# EAGLE schematic Arduino_DUE_Shield_V02d-2Layer (2) (EAGLE 7.1.0)
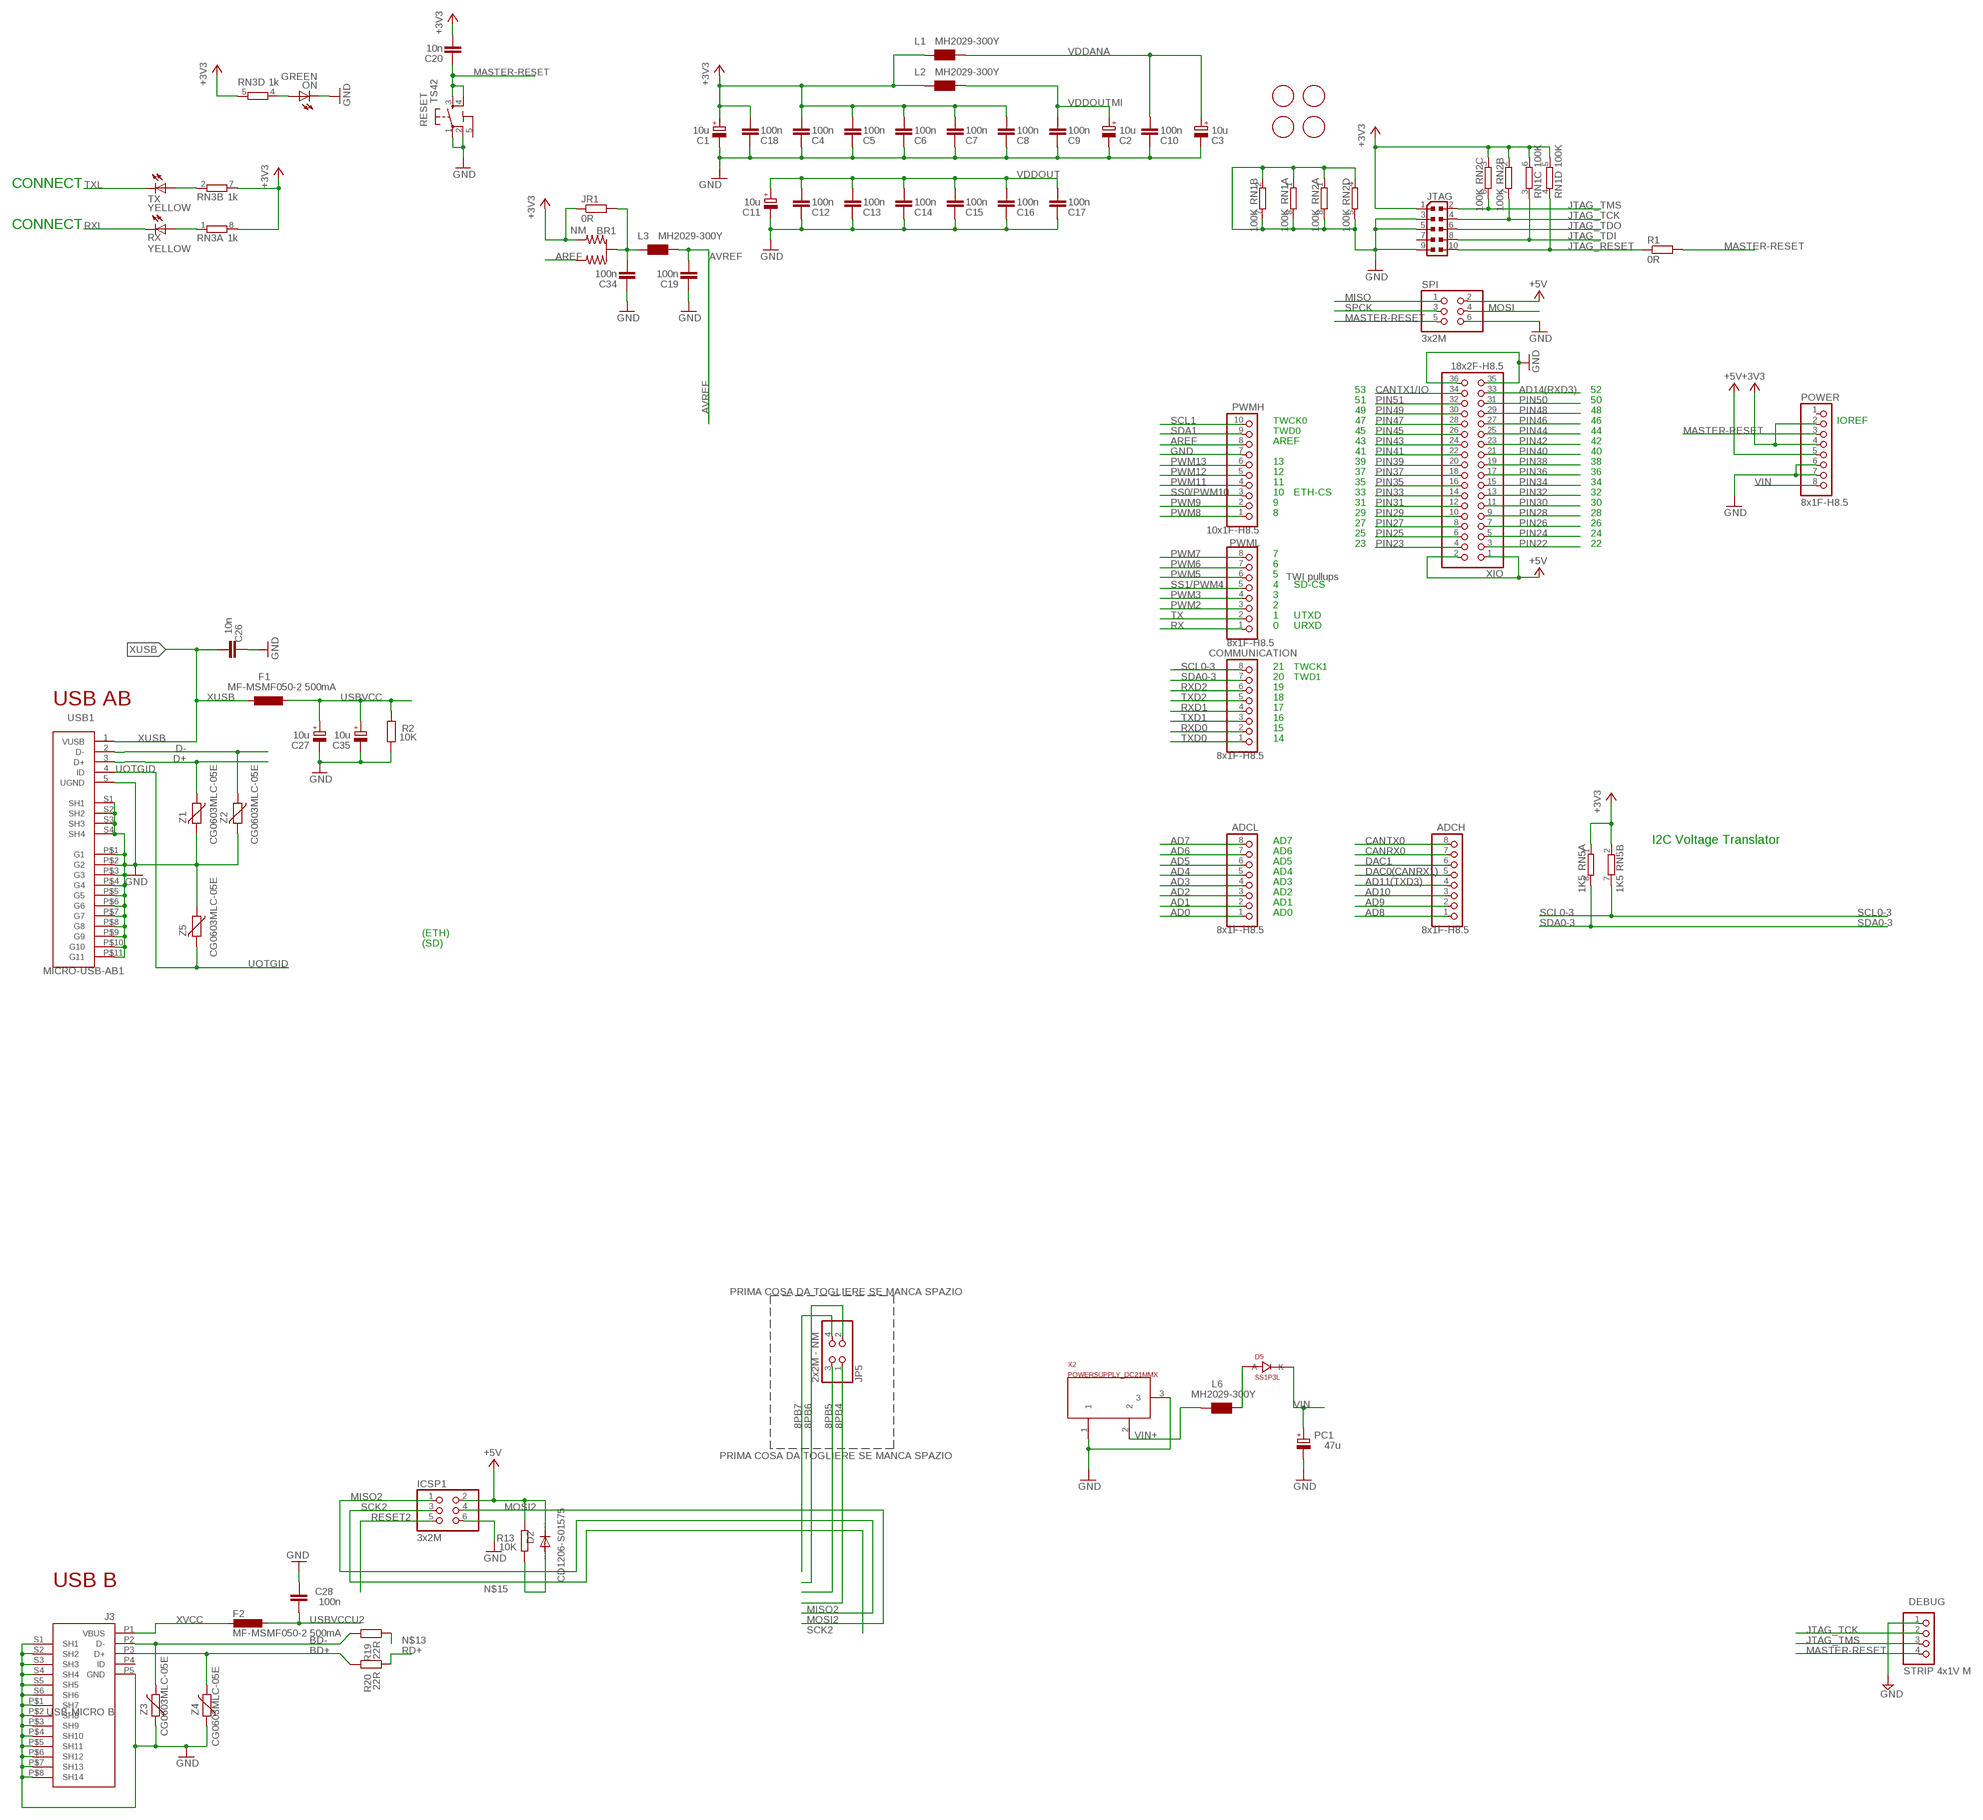
[diagram p0: schematic, sheet 1]

## Parts
ADCH  8x1F-H8.5  PINHD-1X8  [1X08]
ADCL  8x1F-H8.5  PINHD-1X8  [1X08]
BR1  NM  J0402  [J0402]
C1  10u  CPOL-EUSMCB  [SMC_B]
C2  10u  CPOL-EUSMCB  [SMC_B]
C3  10u  CPOL-EUSMCB  [SMC_B]
C4  100n  C-EUC0402  [C0402]
C5  100n  C-EUC0402  [C0402]
C6  100n  C-EUC0402  [C0402]
C7  100n  C-EUC0402  [C0402]
C8  100n  C-EUC0402  [C0402]
C9  100n  C-EUC0402  [C0402]
C10  100n  C-EUC0402  [C0402]
C11  10u  CPOL-EUSMCB  [SMC_B]
C12  100n  C-EUC0402  [C0402]
C13  100n  C-EUC0402  [C0402]
C14  100n  C-EUC0402  [C0402]
C15  100n  C-EUC0402  [C0402]
C16  100n  C-EUC0402  [C0402]
C17  100n  C-EUC0402  [C0402]
C18  100n  C-EUC0402  [C0402]
C19  100n  C-EUC0402  [C0402]
C20  10n  C-EUC0402  [C0402]
C26  10n  C-EUC0402  [C0402]
C27  10u  CPOL-EUSMCB  [SMC_B]
C28  100n  C-EUC0402  [C0402]
C34  100n  C-EUC0402  [C0402]
C35  10u  CPOL-EUSMCB  [SMC_B]
COMMUNICATION  8x1F-H8.5  PINHD-1X8  [1X08]
D2  CD1206-S01575  DIODE-MINIMELF  [MINIMELF]
D5  SS1P3L  [DO220AAL]
DEBUG  STRIP 4x1V M  PINHD-1X4  [1X04]
F1  MF-MSMF050-2 500mA  L-EUL1812  [L1812]
F2  MF-MSMF050-2 500mA  L-EUL1812  [L1812]
FID1  FIDUCIALMOUNT  [FIDUCIA-MOUNT]
FID2  FIDUCIALMOUNT  [FIDUCIA-MOUNT]
FID3  FIDUCIALMOUNT  [FIDUCIA-MOUNT]
FID4  FIDUCIALMOUNT  [FIDUCIA-MOUNT]
ICSP1  3x2M  PINHD-2X3  [2X03]
J3  USB-MICRO B  MYCON2_USB-MINI-B  [CON2_USB_MICRO_B_AT]
JP5  2x2M - NM  PINHD-2X2  [2X02]
JR1  0R  R-EU_R0402  [R0402]
JTAG  PINHEAD_PINHD-2X5PASSO127  [PINHEAD_2X05_127]
L1  MH2029-300Y  WE-CBF_0805  [0805]
L2  MH2029-300Y  WE-CBF_0805  [0805]
L3  MH2029-300Y  WE-CBF_0805  [0805]
L6  MH2029-300Y  WE-CBF_0805  [0805]
ON  GREEN  LEDCHIP-LED0805  [CHIP-LED0805]
PC1  47u  CPOL-EUD  [PANASONIC_D]
POWER  8x1F-H8.5  PINHD-1X8  [1X08]
PWMH  10x1F-H8.5  PINHD-1X10  [1X10]
PWML  8x1F-H8.5  PINHD-1X8  [1X08]
R1  0R  R-EU_R0402  [R0402]
R2  10K  R-EU_R0402  [R0402]
R13  10K  R-EU_R0402  [R0402]
R19  22R  R-EU_R0402  [R0402]
R20  22R  R-EU_R0402  [R0402]
RESET  TS42  [TS42]
RN1  100K  4R-NCAT16  [CAT16]
RN2  100K  4R-NCAT16  [CAT16]
RN3  1k  4R-NCAY16  [CAY16]
RN5  1K5  4R-NCAT16  [CAT16]
RX  YELLOW  LEDCHIP-LED0805  [CHIP-LED0805]
SPI  3x2M  PINHD-2X3  [2X03]
TX  YELLOW  LEDCHIP-LED0805  [CHIP-LED0805]
USB1  MICRO-USB-AB1  MICRO_USB  [MCR-AB1-S-RA-SMT]
X2  POWERSUPPLY_DC21MMX  [POWERSUPPLY_DC-21MM]
XIO  18x2F-H8.5  PINHD-2X18  [2X18]
Z1  CG0603MLC-05E  VARISTORCN0603  [CT/CN0603]
Z2  CG0603MLC-05E  VARISTORCN0603  [CT/CN0603]
Z3  CG0603MLC-05E  VARISTORCN0603  [CT/CN0603]
Z4  CG0603MLC-05E  VARISTORCN0603  [CT/CN0603]
Z5  CG0603MLC-05E  VARISTORCN0603  [CT/CN0603]

## Nets
8PB4: JP5.1
8PB5: JP5.3
8PB6: JP5.2
8PB7: JP5.4
+3V3: BR1.3 C1.+ C4.2 C5.2 C6.2 C7.2 C8.2 C18.2 C20.2 JR1.1 JTAG.1 L1.1 L2.1 POWER.2 POWER.4 RN1.5 RN1.6 RN2.2 RN2.3 RN3.5 RN3.7 RN3.8 RN5.1 RN5.2
+5V: D2.C ICSP1.2 POWER.5 R13.2 SPI.2 XIO.1 XIO.2
AD0: ADCL.1
AD1: ADCL.2
AD2: ADCL.3
AD3: ADCL.4
AD4: ADCL.5
AD5: ADCL.6
AD6: ADCL.7
AD7: ADCL.8
AD8: ADCH.1
AD9: ADCH.2
AD10: ADCH.3
AD11(TXD3): ADCH.4
AD14(RXD3): XIO.33
AREF: BR1.1 PWMH.8
AVREF: C19.2 L3.2
AVREFL: BR1.2(C) C34.2 JR1.2 L3.1
BD+ [USB]: J3.P3(D+) R20.2 Z4.2
BD- [USB]: J3.P2(D-) R19.2 Z3.2
CANRX0: ADCH.7
CANTX0: ADCH.8
CANTX1/IO: XIO.34
D+ [USBpair]: USB1.3(D+) Z1.1
D- [USBpair]: USB1.2(D-) Z2.1
DAC0(CANRX1): ADCH.5
DAC1: ADCH.6
GND: C1.- C2.- C3.- C4.1 C5.1 C6.1 C7.1 C8.1 C9.1 C10.1 C11.- C12.1 C13.1 C14.1 C15.1 C16.1 C17.1 C18.1 C19.1 C26.2 C27.- C28.2 C34.1 C35.- DEBUG.1 ICSP1.6 J3.P5(GND) J3.P$1(SH7) J3.P$2(SH8) J3.P$3(SH9) J3.P$4(SH10) J3.P$5(SH11) J3.P$6(SH12) J3.P$7(SH13) J3.P$8(SH14) J3.S1(SH1) J3.S2(SH2) J3.S3(SH3) J3.S4(SH4) J3.S5(SH5) J3.S6(SH6) JTAG.3 JTAG.5 JTAG.9 ON.C PC1.- POWER.6 POWER.7 PWMH.7 R2.1 RESET.1 RESET.2 RN1.1 RN1.2 RN1.7 RN1.8 RN2.1 RN2.4 RN2.5 RN2.8 SPI.6 USB1.5(UGND) USB1.P$1(G1) USB1.P$2(G2) USB1.P$3(G3) USB1.P$4(G4) USB1.P$5(G5) USB1.P$6(G6) USB1.P$7(G7) USB1.P$8(G8) USB1.P$9(G9) USB1.P$10(G10) USB1.P$11(G11) USB1.S1(SH1) USB1.S2(SH2) USB1.S3(SH3) USB1.S4(SH4) X2.1 X2.3 XIO.35 XIO.36 Z1.2 Z2.2 Z3.1 Z4.1 Z5.1
JTAG_RESET: JTAG.10 R1.1 RN1.4
JTAG_TCK: DEBUG.2 JTAG.4 RN2.7
JTAG_TDI: JTAG.8 RN1.3
JTAG_TDO: JTAG.6
JTAG_TMS: DEBUG.3 JTAG.2 RN2.6
MASTER-RESET: C20.1 DEBUG.4 POWER.3 R1.2 RESET.3 RESET.4 SPI.5
MISO: SPI.1
MISO2: ICSP1.1
MOSI: SPI.4
MOSI2: ICSP1.4
N$3: ON.A RN3.4
N$10: D5.P$2(A) L6.1
N$13: R19.1
N$15: D2.A R13.1
N$54: RN3.1 RX.A
N$55: RN3.2 TX.A
PIN22: XIO.3
PIN23: XIO.4
PIN24: XIO.5
PIN25: XIO.6
PIN26: XIO.7
PIN27: XIO.8
PIN28: XIO.9
PIN29: XIO.10
PIN30: XIO.11
PIN31: XIO.12
PIN32: XIO.13
PIN33: XIO.14
PIN34: XIO.15
PIN35: XIO.16
PIN36: XIO.17
PIN37: XIO.18
PIN38: XIO.19
PIN39: XIO.20
PIN40: XIO.21
PIN41: XIO.22
PIN42: XIO.23
PIN43: XIO.24
PIN44: XIO.25
PIN45: XIO.26
PIN46: XIO.27
PIN47: XIO.28
PIN48: XIO.29
PIN49: XIO.30
PIN50: XIO.31
PIN51: XIO.32
PWM2: PWML.3
PWM3: PWML.4
PWM5: PWML.6
PWM6: PWML.7
PWM7: PWML.8
PWM8: PWMH.1
PWM9: PWMH.2
PWM11: PWMH.4
PWM12: PWMH.5
PWM13: PWMH.6
RD+: R20.1
RESET2: ICSP1.5
RX: PWML.1
RXD0: COMMUNICATION.2
RXD1: COMMUNICATION.4
RXD2: COMMUNICATION.6
RXL: RX.C
SCK2: ICSP1.3
SCL0-3: COMMUNICATION.8 RN5.7
SCL1: PWMH.10
SDA0-3: COMMUNICATION.7 RN5.8
SDA1: PWMH.9
SPCK: SPI.3
SS0/PWM10: PWMH.3
SS1/PWM4: PWML.5
TX: PWML.2
TXD0: COMMUNICATION.1
TXD1: COMMUNICATION.3
TXD2: COMMUNICATION.5
TXL: TX.C
UOTGID: USB1.4(ID) Z5.2
USBVCC: C27.+ C35.+ F1.1 R2.2
USBVCCU2: C28.1 F2.1
VDDANA: C3.+ C10.2 L1.2
VDDOUT: C11.+ C12.2 C13.2 C14.2 C15.2 C16.2 C17.2
VDDOUTMI: C2.+ C9.2 L2.2
VIN: D5.P$1(K) PC1.+ POWER.8
VIN+: L6.2 X2.2
XUSB [usbvcc]: C26.1 F1.2 USB1.1(VUSB)
XVCC [usbvcc]: F2.2 J3.P1(VBUS)
Unconnected: J3.P4(ID) JTAG.7 POWER.1 RN3.3 RN3.6 RN5.3 RN5.4 RN5.5 RN5.6

## Notes on the sheet
- CONNECT
- CONNECT
- 53 | 52
- 51 | 50
- 49 | 48
- TWCK0 | 47 | 46 | IOREF
- TWD0 | 45 | 44
- AREF | 43 | 42
- 41 | 40
- 13 | 39 | 38
- 12 | 37 | 36
- 11 | 35 | 34
- 10 | ETH-CS | 33 | 32
- 9 | 31 | 30
- 8 | 29 | 28
- 27 | 26
- 25 | 24
- 23 | 22
- 7
- 6
- 5 | TWI pullups
- 4 | SD-CS
- 3
- 2
- 1 | UTXD
- 0 | URXD
- 21 | TWCK1
- 20 | TWD1
- USB AB | 19
- 18
- 17
- 16
- 15
- 14
- AD7 | I2C Voltage Translator
- AD6
- AD5
- AD4
- AD3
- AD2
- AD1
- AD0
- (ETH)
- (SD)
- PRIMA COSA DA TOGLIERE SE MANCA SPAZIO
- PRIMA COSA DA TOGLIERE SE MANCA SPAZIO
- USB B

## Power pins joined to a net without a drawn wire
5-GND: RESET.5(5-GND)

## Library data of the parts
ADCH ADCL COMMUNICATION POWER PWML = SmartPrj:PINHD-1X8: PIN HEADER
BR1 = bibaja:J: Three terminal jumper made from two 0402, 0603, 0805, etc.
C1-C3 C11 C27 C35 PC1 = rcl:CPOL-EU: POLARIZED CAPACITOR, European symbol
C4-C10 C12-C20 C26 C28 C34 = SmartPrj:C-EU: CAPACITOR, European symbol
D2 = diode:DIODE-: DIODE
D5 = SmartPrj:SS1P3L
DEBUG = pinhead:PINHD-1X4: PIN HEADER
F1 F2 = rcl:L-EU: INDUCTOR, European symbol
FID1-FID4 = SmartPrj:FIDUCIALMOUNT
ICSP1 SPI = SmartPrj:PINHD-2X3: PIN HEADER
J3 = SmartPrj:MYCON2_USB-MINI-B
JP5 = SmartPrj:PINHD-2X2: PIN HEADER
JR1 R1 R2 R13 R19 R20 = SmartPrj:R-EU_: RESISTOR, European symbol
JTAG = Arduino_Wifi_shield_v018_tG:PINHEAD_PINHD-2X5: PIN HEADER
L1-L3 L6 = wuerth-elektronik:WE-CBF: SMD EMI Suppression Ferrite Beads - excellent anti-EMI properties - low DCR - impedances till 3000 ohms - rated current up to 6 A
ON RX TX = led:LED: LED OSRAM: - CHIPLED LG R971, LG N971, LY N971, LG Q971, LY Q971, LO R971, LY R971 LH N974, LH R974 LS Q976, LO Q976, LY Q976 LO Q996 - Hyper CHIPLED LW Q18S LB Q993, LB Q99A, LB R99A - SideLED LS A670, LO A670, LY A670, LG A670, LP A670 LB A673, LV A673, LT A673, LW A673 LH A674 LY A675 LS A676, LA A676, LO A676, LY A676, LW A676 LS A679, LY A679, LG A679 - Hyper Micro SIDELED® LS Y876, LA Y876, LO Y876, LY Y876 LT Y87S - SmartLED LW L88C, LW L88S LB L89C, LB L89S, LG L890 LS L89K, LO L89K, LY L89K LS L896, LA L896, LO L896, LY L896 - TOPLED LS T670, LO T670, LY T670, LG T670, LP T670 LSG T670, LSP T670, LSY T670, LOP T670, LYG T670 LG T671, LOG T671, LSG T671 LB T673, LV T673, LT T673, LW T673 LH T674 LS T676, LA T676, LO T676, LY T676, LB T676, LH T676, LSB T676, LW T676 LB T67C, LV T67C, LT T67C, LS T67K, LO T67K, LY T67K, LW E67C LS E67B, LA E67B, LO E67B, LY E67B, LB E67C, LV E67C, LT E67C LW T67C LS T679, LY T679, LG T679 LS T770, LO T770, LY T770, LG T770, LP T770 LB T773, LV T773, LT T773, LW T773 LH T774 LS E675, LA E675, LY E675, LS T675 LS T776, LA T776, LO T776, LY T776, LB T776 LHGB T686 LT T68C, LB T68C - Hyper Mini TOPLED® LB M676 - Mini TOPLED Santana® LG M470 LS M47K, LO M47K, LY M47K Source: http://www.osram.convergy.de LUXEON: - LUMILED® LXK2-PW12-R00, LXK2-PW12-S00, LXK2-PW14-U00, LXK2-PW14-V00 LXK2-PM12-R00, LXK2-PM12-S00, LXK2-PM14-U00 LXK2-PE12-Q00, LXK2-PE12-R00, LXK2-PE12-S00, LXK2-PE14-T00, LXK2-PE14-U00 LXK2-PB12-K00, LXK2-PB12-L00, LXK2-PB12-M00, LXK2-PB14-N00, LXK2-PB14-P00, LXK2-PB14-Q00 LXK2-PR12-L00, LXK2-PR12-M00, LXK2-PR14-Q00, LXK2-PR14-R00 LXK2-PD12-Q00, LXK2-PD12-R00, LXK2-PD12-S00 LXK2-PH12-R00, LXK2-PH12-S00 LXK2-PL12-P00, LXK2-PL12-Q00, LXK2-PL12-R00 Source: www.luxeon.com KINGBRIGHT: KA-3528ASYC Source: www.kingbright.com
PWMH = SmartPrj:PINHD-1X10: PIN HEADER
RESET = SmartPrj:TS42: TS42 Dongnan Electronics Tact switch VDC 12V - 50mA
RN1-RN3 RN5 = resistor-dil:4R-N: Array Chip Resistor Source: RS Component / Phycomp; OC_FARNELL: unknown; OC_NEWARK: unknown
USB1 = SmartPrj:MICRO_USB: Micro_USB ADAM-TECH MCR-AB1-S-RA-SMT
X2 = SmartPrj:POWERSUPPLY_DC21MM
XIO = SmartPrj:PINHD-2X18: PIN HEADER
Z1-Z5 = varistor:VARISTOR: VARISTOR

## Net classes
0 default: width 0.203 mm, drill 0.406 mm, clearance 0.203 mm
1 USB: width 0.203 mm, drill 0.406 mm, clearance 0.203 mm
2 gnd: width 0.203 mm, drill 0.406 mm, clearance 0.203 mm
3 usbvcc: width 0.203 mm, drill 0.406 mm, clearance 0.203 mm
4 USBpair: width 0.254 mm, drill 0.406 mm, clearance 0.61 mm